# EAGLE schematic KombyPiRTC (EAGLE 7.2.0)
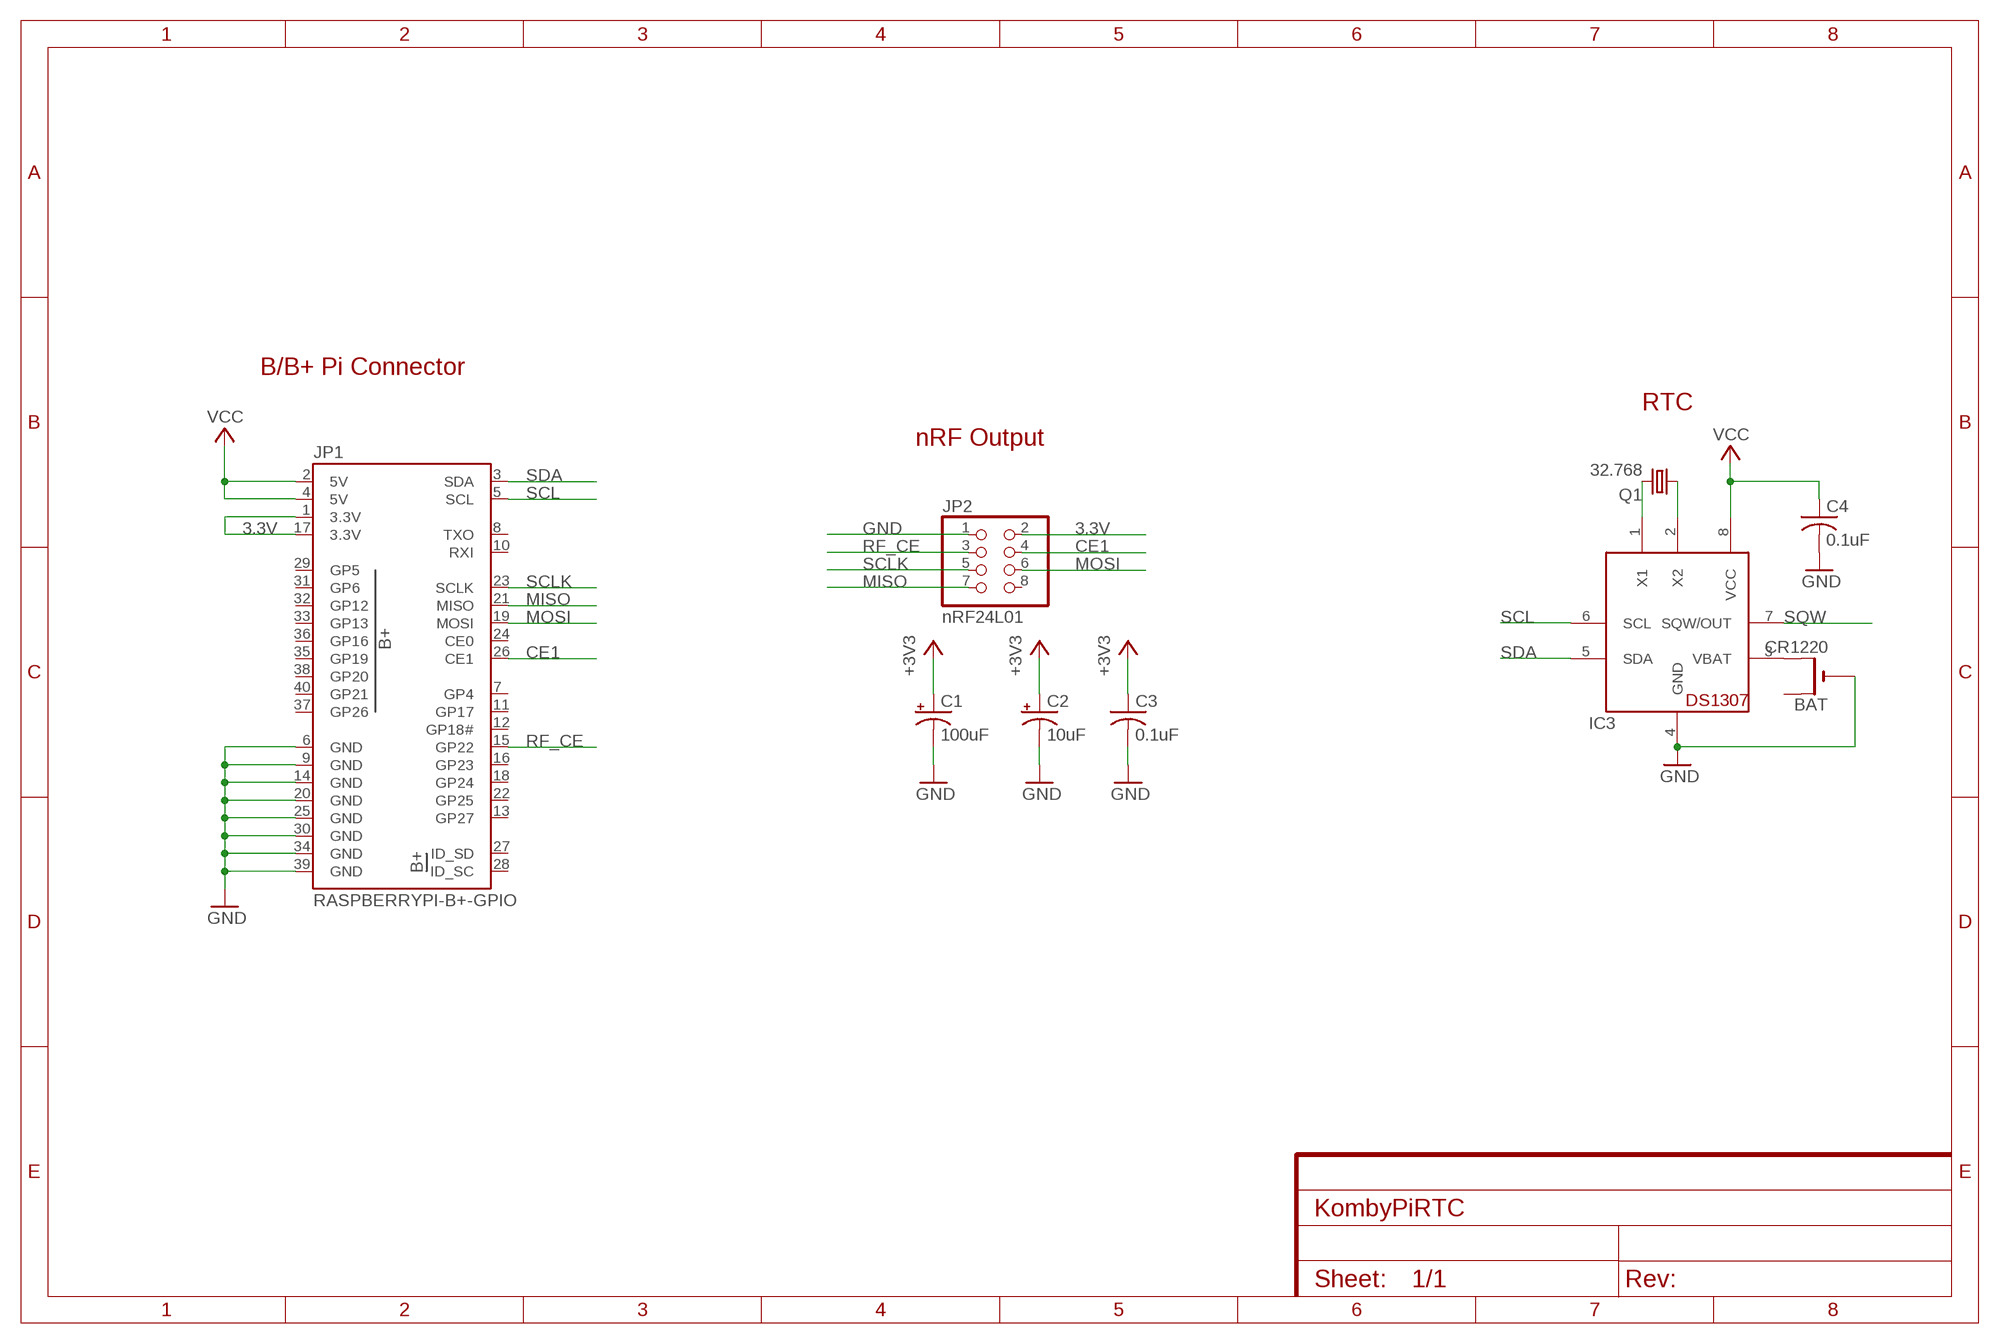
[diagram p0: schematic, sheet 1]

## Parts
BAT  CR1220  CR1220THM  [CR1220-THM]
C1  100uF  CAP_POLPTH1  [CPOL-RADIAL-100UF-25V]
C2  10uF  CAP_POLPTH2  [CPOL-RADIAL-10UF-25V]
C3  0.1uF  C-US025-025X050  [C025-025X050]
C4  0.1uF  C-US025-025X050  [C025-025X050]
IC3  DS1307  [DIL08]
JP1  RASPBERRYPI-B+-GPIO  [2X20-SHROUDED]
JP2  nRF24L01  NRF_HEADER  [2X04]
Q1  32.768  CRYTALTC38H  [TC38H]

## Nets
3.3V [RFBoard]: C1.1(+) C2.1(+) C3.1 JP1.1(3.3V) JP1.17(3.3V) JP2.2(VCC) ; supply symbol labelled +3V3
CE1 [RFBoard]: JP1.26(CE1) JP2.4(CSN)
GND: BAT.- C1.2(-) C2.2(-) C3.2 C4.2 IC3.4(GND) JP1.6(GND) JP1.9(GND) JP1.14(GND) JP1.20(GND) JP1.25(GND) JP1.30(GND) JP1.34(GND) JP1.39(GND) JP2.1(GND)
MISO [RFBoard]: JP1.21(MISO) JP2.7(MISO)
MOSI [RFBoard]: JP1.19(MOSI) JP2.6(MOSI)
N$14: IC3.1(X1) Q1.2
N$15: IC3.2(X2) Q1.1
N$39: BAT.+2(+1) IC3.3(VBAT)
RF_CE [RFBoard]: JP1.15(GP22) JP2.3(CE)
SCL: IC3.6(SCL) JP1.5(SCL)
SCLK: JP1.23(SCLK) JP2.5(SCK)
SDA: IC3.5(SDA) JP1.3(SDA)
SQW: IC3.7(SQW/OUT)
VCC: C4.1 IC3.8(VCC) JP1.2(5V) JP1.4(5V)
Unconnected: BAT.+1(+) JP1.7(GP4) JP1.8(TXO) JP1.10(RXI) JP1.11(GP17) JP1.12(GP18#) JP1.13(GP27) JP1.16(GP23) JP1.18(GP24) JP1.22(GP25) JP1.24(CE0) JP1.27(ID_SD) JP1.28(ID_SC) JP1.29(GP5) JP1.31(GP6) JP1.32(GP12) JP1.33(GP13) JP1.35(GP19) JP1.36(GP16) JP1.37(GP26) JP1.38(GP20) JP1.40(GP21) JP2.8(IRQ)

## Notes on the sheet
- B/B+ Pi Connector
- RTC
- nRF Output

## Library data of the parts
BAT = adafruit:CR1220: CR1216/CR1220/CR1225 12mm 3V lithium coin cell Great for battery packup. Both SMT and THM holders. Note the THM package has the ground pads on both sides of the PCB so that the masks are the same - this reduces the cost
C1 C2 = SparkFun:CAP_POL: Capacitor Polarized These are standard SMD and PTH capacitors. Normally 10uF, 47uF, and 100uF in electrolytic and tantalum varieties. Always verify the external diameter of the through hole cap, it varies with capacity, voltage, and manufacturer. The EIA devices should be standard.
C3 C4 = adafruit:C-US: CAPACITOR, American symbol
IC3 = adafruit:DS1307: DS1307 Real time clock (RTC) with battery backup ability. Talk to it via i2c
JP1 = SparkFun-Boards:RASPBERRYPI-B+-GPIO: Raspberry Pi B+ GPIO Header 2x20 pin connector
JP2 = Materdaddy-Custom:NRF_HEADER: PIN HEADER
Q1 = crystal:CRYTAL: CRYSTAL

## Net classes
1 RFBoard: width 0.406 mm